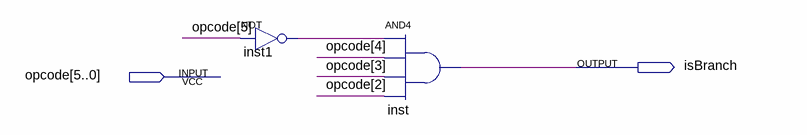
[diagram p0: schematic sheet]
// Quartus schematic branch_rec.bdf as structural Verilog: 2 symbols, 2 pins
module branch_rec (
  input  [5:0] opcode,
  output isBranch
);

  wire inst1_out;

  not inst1 (inst1_out, opcode[5]);
  and inst (isBranch, inst1_out, opcode[4], opcode[3], opcode[2]);
endmodule
